# EAGLE design Gram Piano (EAGLE 6.5.0)
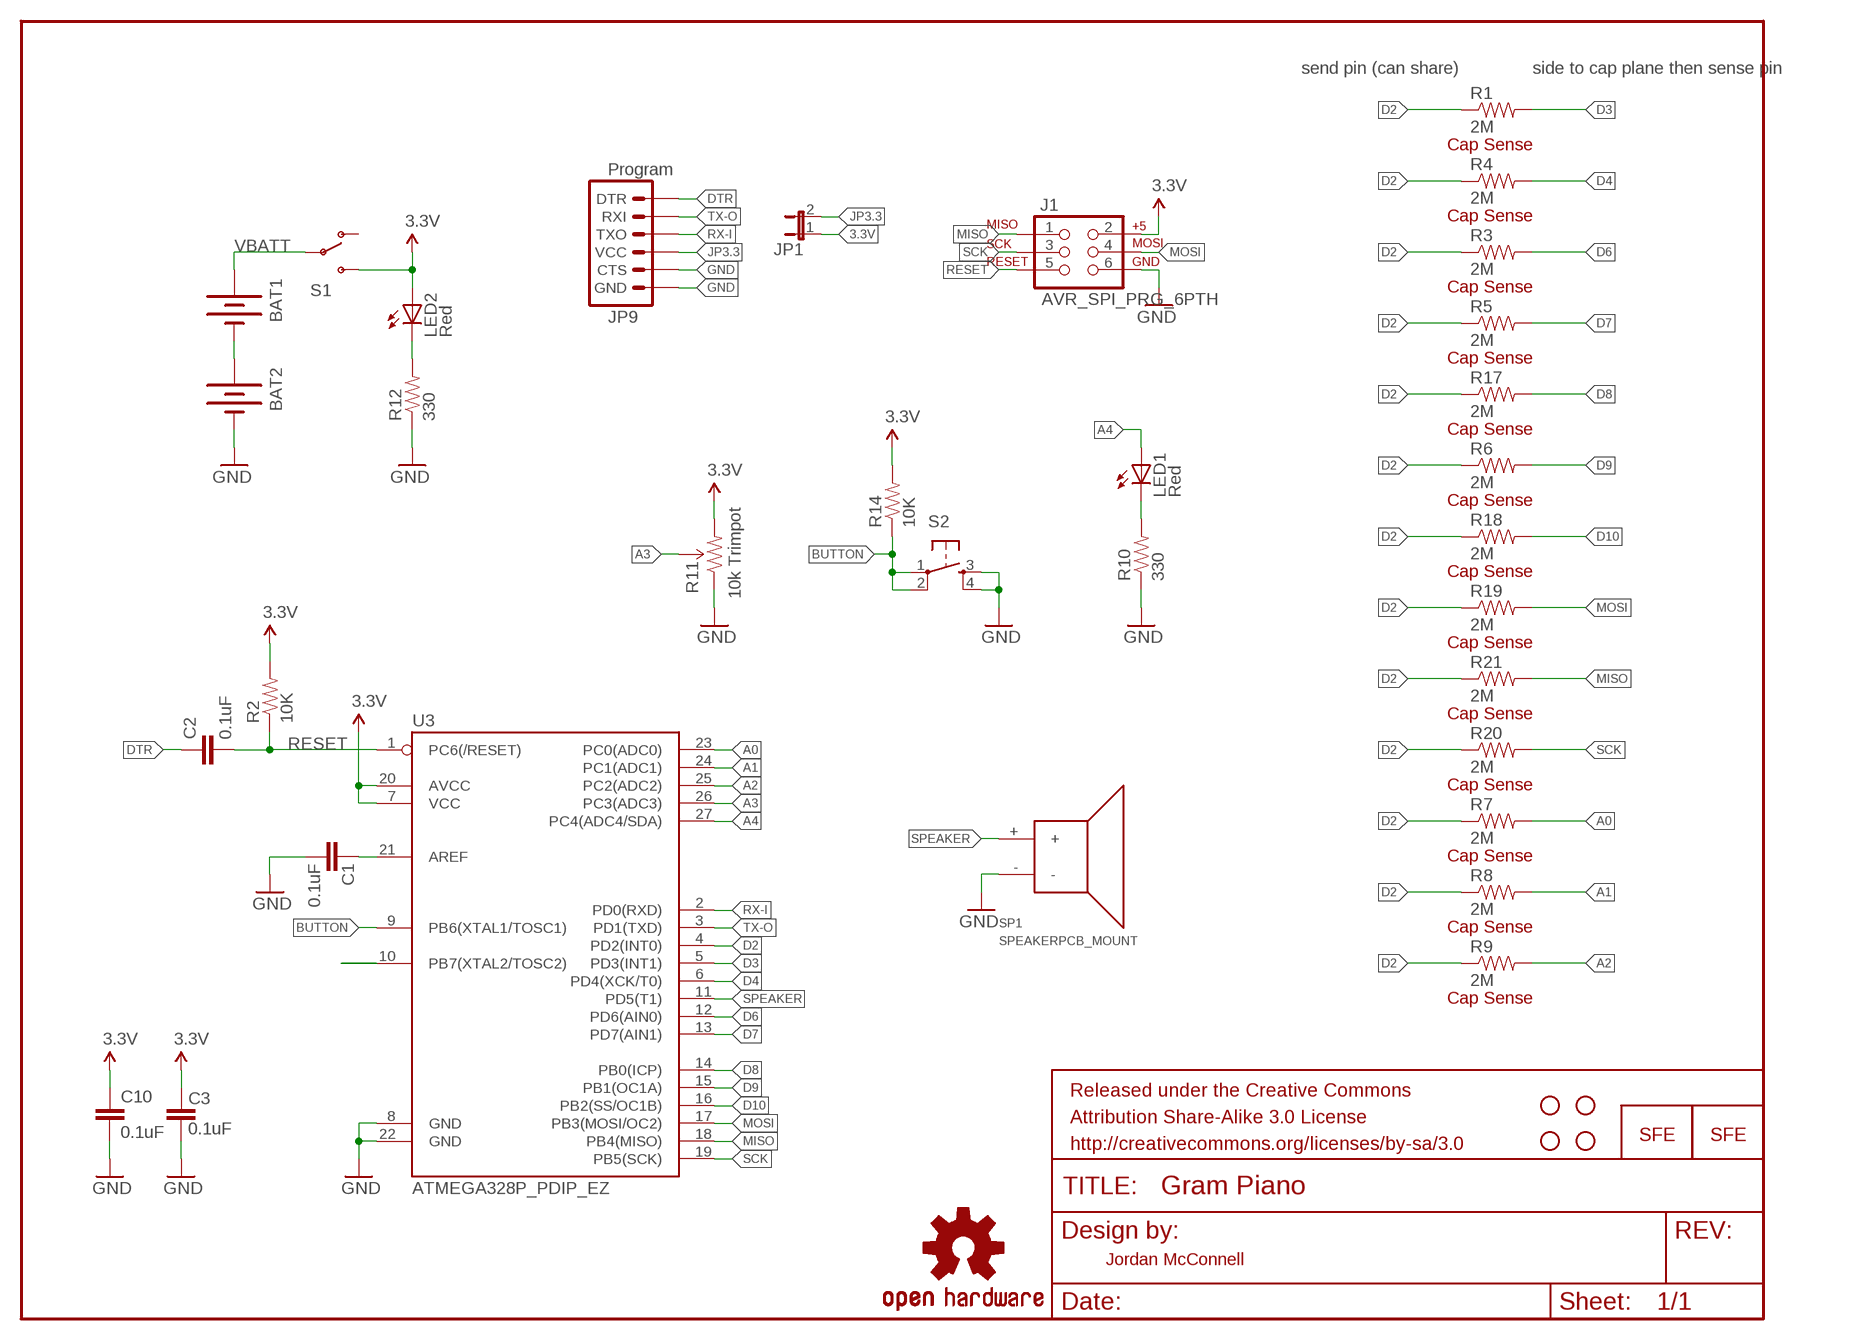
[diagram p0: schematic, sheet 1]

## Parts
BAT1  BATTERYAA-KIT  [BATTERY-AA-KIT]
BAT2  BATTERYAA-KIT  [BATTERY-AA-KIT]
C1  0.1uF  CAPKIT  [CAP-PTH-SMALL-KIT]
C2  0.1uF  CAPKIT  [CAP-PTH-SMALL-KIT]
C3  0.1uF  CAPKIT  [CAP-PTH-SMALL-KIT]
C10  0.1uF  CAPKIT  [CAP-PTH-SMALL-KIT]
FRAME2  FRAME-LETTER  [CREATIVE_COMMONS]
J1  AVR_SPI_PRG_6PTH  [2X3]
JP1  JUMPER-2SMD-NO  [SJ_2S-NO]
JP9  Program  ARDUINO_SERIAL_PROGRAMPTH-KIT  [1X06-KIT]
LED1  Red  LED5MM-KIT  [LED5MM-KIT]
LED2  Red  LED5MM-KIT  [LED5MM-KIT]
LOGO1  LOGO-SFENEW  [SFE-NEW-WEBLOGO]
LOGO2  LOGO-SFENEW  [SFE-NEW-WEBLOGO]
LOGO3  OSHW-LOGOM  [OSHW-LOGO-M]
R1  2M  RESISTORPTH-1/4W  [AXIAL-0.4]
R2  10K  RESISTORPTH-1/4W  [AXIAL-0.4]
R3  2M  RESISTORPTH-1/4W  [AXIAL-0.4]
R4  2M  RESISTORPTH-1/4W  [AXIAL-0.4]
R5  2M  RESISTORPTH-1/4W  [AXIAL-0.4]
R6  2M  RESISTORPTH-1/4W  [AXIAL-0.4]
R7  2M  RESISTORPTH-1/4W  [AXIAL-0.4]
R8  2M  RESISTORPTH-1/4W  [AXIAL-0.4]
R9  2M  RESISTORPTH-1/4W  [AXIAL-0.4]
R10  330  RESISTORPTH-1/4W  [AXIAL-0.4]
R11  TRIMPOT-PTH-KNOB  [3386U]
R12  330  RESISTORPTH-1/4W  [AXIAL-0.4]
R14  10K  RESISTORPTH-1/4W  [AXIAL-0.4]
R17  2M  RESISTORPTH-1/4W  [AXIAL-0.4]
R18  2M  RESISTORPTH-1/4W  [AXIAL-0.4]
R19  2M  RESISTORPTH-1/4W  [AXIAL-0.4]
R20  2M  RESISTORPTH-1/4W  [AXIAL-0.4]
R21  2M  RESISTORPTH-1/4W  [AXIAL-0.4]
S1  SWITCH-SPDTKIT  [SWITCH-SPDT_KIT]
S2  TAC_SWITCHPTH  [TACTILE-PTH]
SP1  SPEAKERPCB_MOUNT  [PCB_MOUNT_SPEAKER]
STANDOFF1  STAND-OFF  [STAND-OFF]
STANDOFF2  STAND-OFF  [STAND-OFF]
STANDOFF3  STAND-OFF  [STAND-OFF]
STANDOFF4  STAND-OFF  [STAND-OFF]
U3  ATMEGA328P_PDIP_EZ  [DIL28-EZ]

## Nets
3.3V: C3.2 C10.1 J1.2 JP1.1 LED2.A R2.P$2 R11.3(CW) R14.P$2 S1.3(S) U3.7(VCC) U3.20(AVCC)
A0: R7.P$2 U3.23(PC0(ADC0))
A1: R8.P$2 U3.24(PC1(ADC1))
A2: R9.P$2 U3.25(PC2(ADC2))
A3: R11.2(WIPER) U3.26(PC3(ADC3))
A4: LED1.A U3.27(PC4(ADC4/SDA))
AREF: C1.2 U3.21(AREF)
BUTTON: R14.P$1 S2.1 S2.2 U3.9(PB6(XTAL1/TOSC1))
D2: R1.P$1 R3.P$1 R4.P$1 R5.P$1 R6.P$1 R7.P$1 R8.P$1 R9.P$1 R17.P$1 R18.P$1 R19.P$1 R20.P$1 R21.P$1 U3.4(PD2(INT0))
D3: R1.P$2 U3.5(PD3(INT1))
D4: R4.P$2 U3.6(PD4(XCK/T0))
D6: R3.P$2 U3.12(PD6(AIN0))
D7 [vcc]: R5.P$2 U3.13(PD7(AIN1))
D8 [vcc]: R17.P$2 U3.14(PB0(ICP))
D9 [vcc]: R6.P$2 U3.15(PB1(OC1A))
D10: R18.P$2 U3.16(PB2(SS/OC1B))
DTR: C2.1 JP9.1(DTR)
GND [vcc]: BAT2.GND@1(-) C1.1 C3.1 C10.2 J1.6 JP9.5(CTS) JP9.6(GND) R10.P$1 R11.1(CCW) R12.P$1 S2.3 S2.4 SP1.- U3.8(GND) U3.22(GND)
JP3.3: JP1.2 JP9.4(VCC)
MISO: J1.1 R21.P$2 U3.18(PB4(MISO))
MOSI: J1.4 R19.P$2 U3.17(PB3(MOSI/OC2))
N$1: LED2.K(C) R12.P$2
N$2: U3.10(PB7(XTAL2/TOSC2))
N$3: BAT1.GND@1(-) BAT2.PWR@1(+)
N$5: LED1.K(C) R10.P$2
RESET: C2.2 J1.5 R2.P$1 U3.1(PC6(/RESET))
RX-I: JP9.3(TXO) U3.2(PD0(RXD))
SCK: J1.3 R20.P$2 U3.19(PB5(SCK))
SPEAKER: SP1.+ U3.11(PD5(T1))
TX-O: JP9.2(RXI) U3.3(PD1(TXD))
VBATT: BAT1.PWR@1(+) S1.2(P)
Unconnected: S1.1(O)

## Notes on the sheet
- send pin (can share) | side to cap plane then sense pin
- Cap Sense
- Cap Sense
- Cap Sense
- Cap Sense
- Cap Sense
- Cap Sense
- Cap Sense
- 10k Trimpot
- Cap Sense
- Cap Sense
- Cap Sense
- Cap Sense
- Cap Sense
- Cap Sense
- Jordan McConnell

## Library data of the parts
BAT1 BAT2 = SparkFun-Electromechanical:BATTERY: Battery Holders Various common sizes : AA, AAA, 20mm coin cell and 12mm coin cell. 20MM_4LEGS, BATT-10373
C1-C3 C10 = SparkFun-Capacitors:CAP: Capacitor Standard 0603 ceramic capacitor, and 0.1" leaded capacitor.
FRAME2 = SparkFun-Aesthetics:FRAME-LETTER: Schematic Frame Standard 8.5x11 US Letter frame
J1 = SparkFun-Connectors:AVR_SPI_PRG_6: AVR ISP 6 Pin This is the reduced ISP connector for AVR programming. Common on Arduino. This footprint will take up less PCB space and can be used with a 10-pin to 6-pin adapter such as SKU: BOB-08508
JP1 = SparkFun-Passives:JUMPER-2: Jumper Basic 0.1" spaced jumper. Use with breakaway headers.
JP9 = SparkFun-Connectors:ARDUINO_SERIAL_PROGRAM: FTDI connector footprints
LED1 LED2 = SparkFun-LED:LED: LEDs Standard schematic elements and footprints for 5mm, 3mm, 1206, and 0603 sized LEDs. 5mm - Spark Fun Electronics SKU : COM-00529 (and others)
LOGO1 LOGO2 = SparkFun-Aesthetics:LOGO-SFE: Spark Fun Electronics PCB Logo This is the standard Spark Fun Electronics PCB logo.
LOGO3 = SparkFun-Aesthetics:OSHW-LOGO: Open Source Hardware Logo This logo indicates the piece of hardware it is found on incorporates a OSHW license and/or adheres to the definition of open source hardware found here: http://freedomdefined.org/OSHW
R1-R10 R12 R14 R17-R21 = SparkFun-Resistors:RESISTOR: Resistor Basic schematic elements and footprints for 0603, 1206, and PTH resistors.
R11 = SparkFun-Electromechanical:TRIMPOT: Various small potentiometers for "set-and-forget" applications
S1 = SparkFun-Electromechanical:SWITCH-SPDT: SPDT Switch Simple slide switch, Spark Fun Electronics SKU : COM-00102 DPDT SMT slide switch, AYZ0202, SWCH-08179
S2 = SparkFun-Electromechanical:TAC_SWITCH: Momentary Switch Button commonly used for reset or general input. Spark Fun Electronics SKU : COM-00097 SMT- SWCH-08247
SP1 = SparkFun-Electromechanical:SPEAKER: General speakers.; MFG: SANCO; PROD_#: NA; SKU: COM-11089; SPARKLE_ID: 6504
STANDOFF1-STANDOFF4 = SparkFun-Electromechanical:STAND-OFF: #4 Stand Off This is the mechanical footprint for a #4 phillips button head screw. Use the keepout ring to avoid running the screw head into surrounding components. SKU : PRT-00447
U3 = SparkFun-DigitalIC:ATMEGA328P_PDIP_EZ: uC used in the Arduino 32kb flash, 1k EEPROM, 2k SRAM This is the through-hole version of this chip.

## Net classes
0 default: width 0.152 mm, drill 0.305 mm, clearance 0.152 mm
1 vcc: width 0.254 mm

## Board
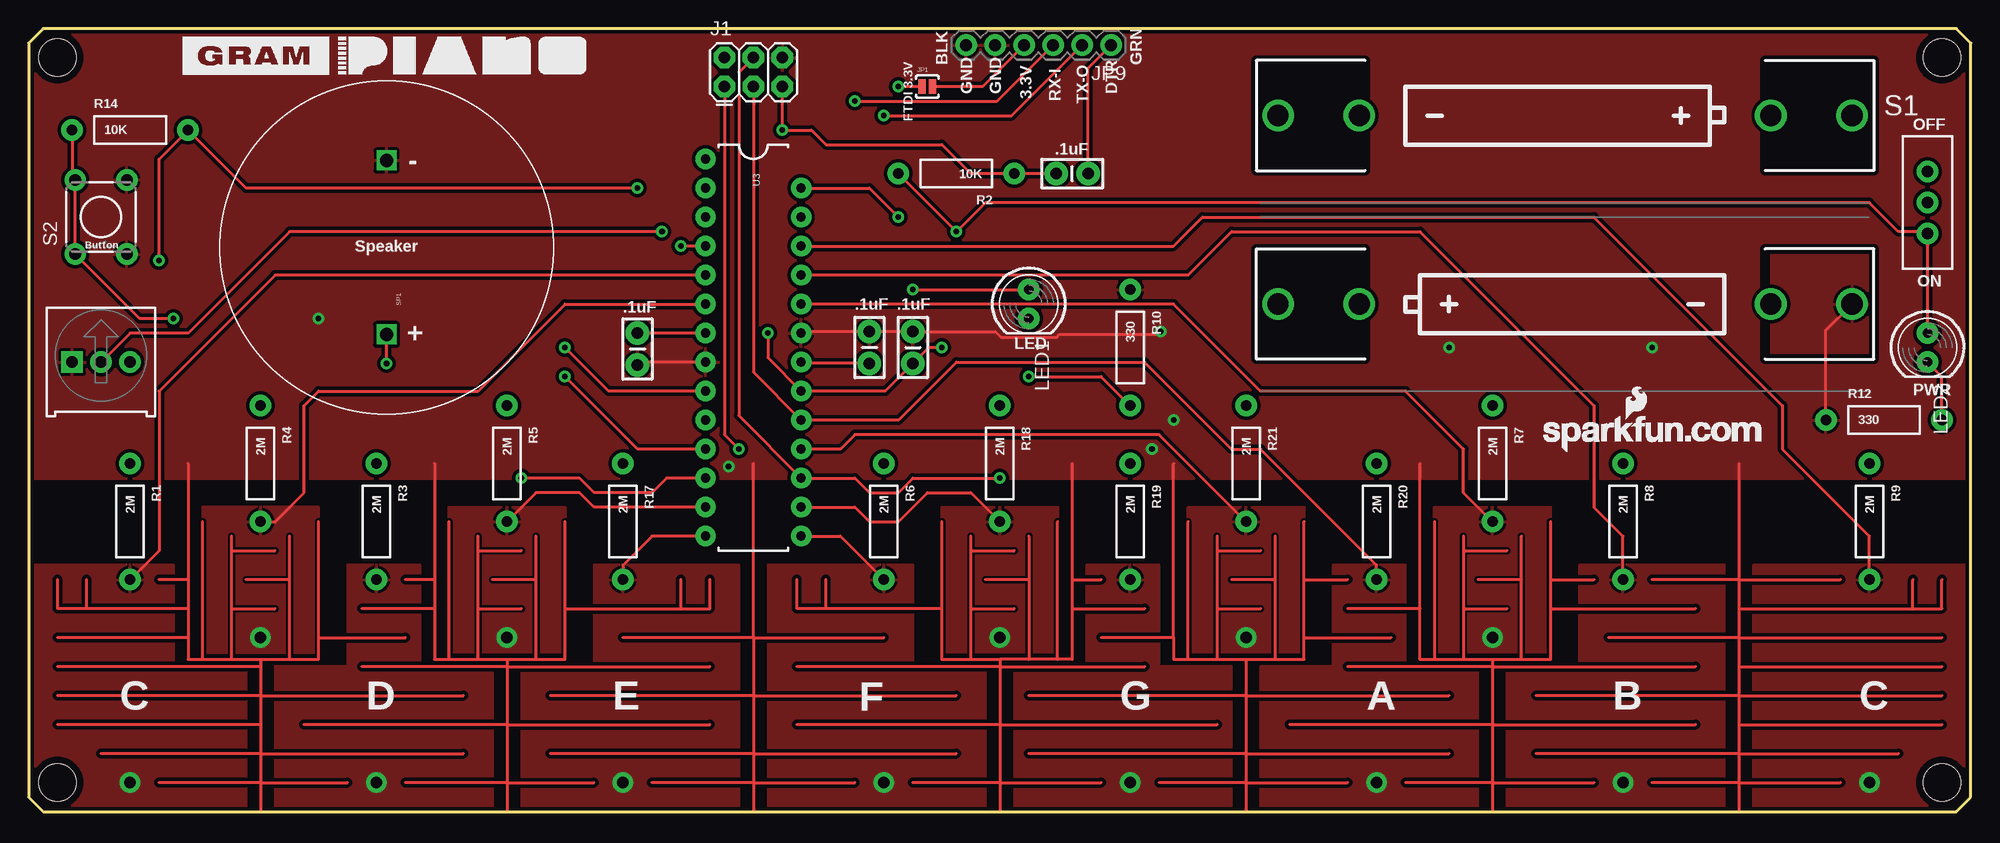
[diagram p1: board, top side]
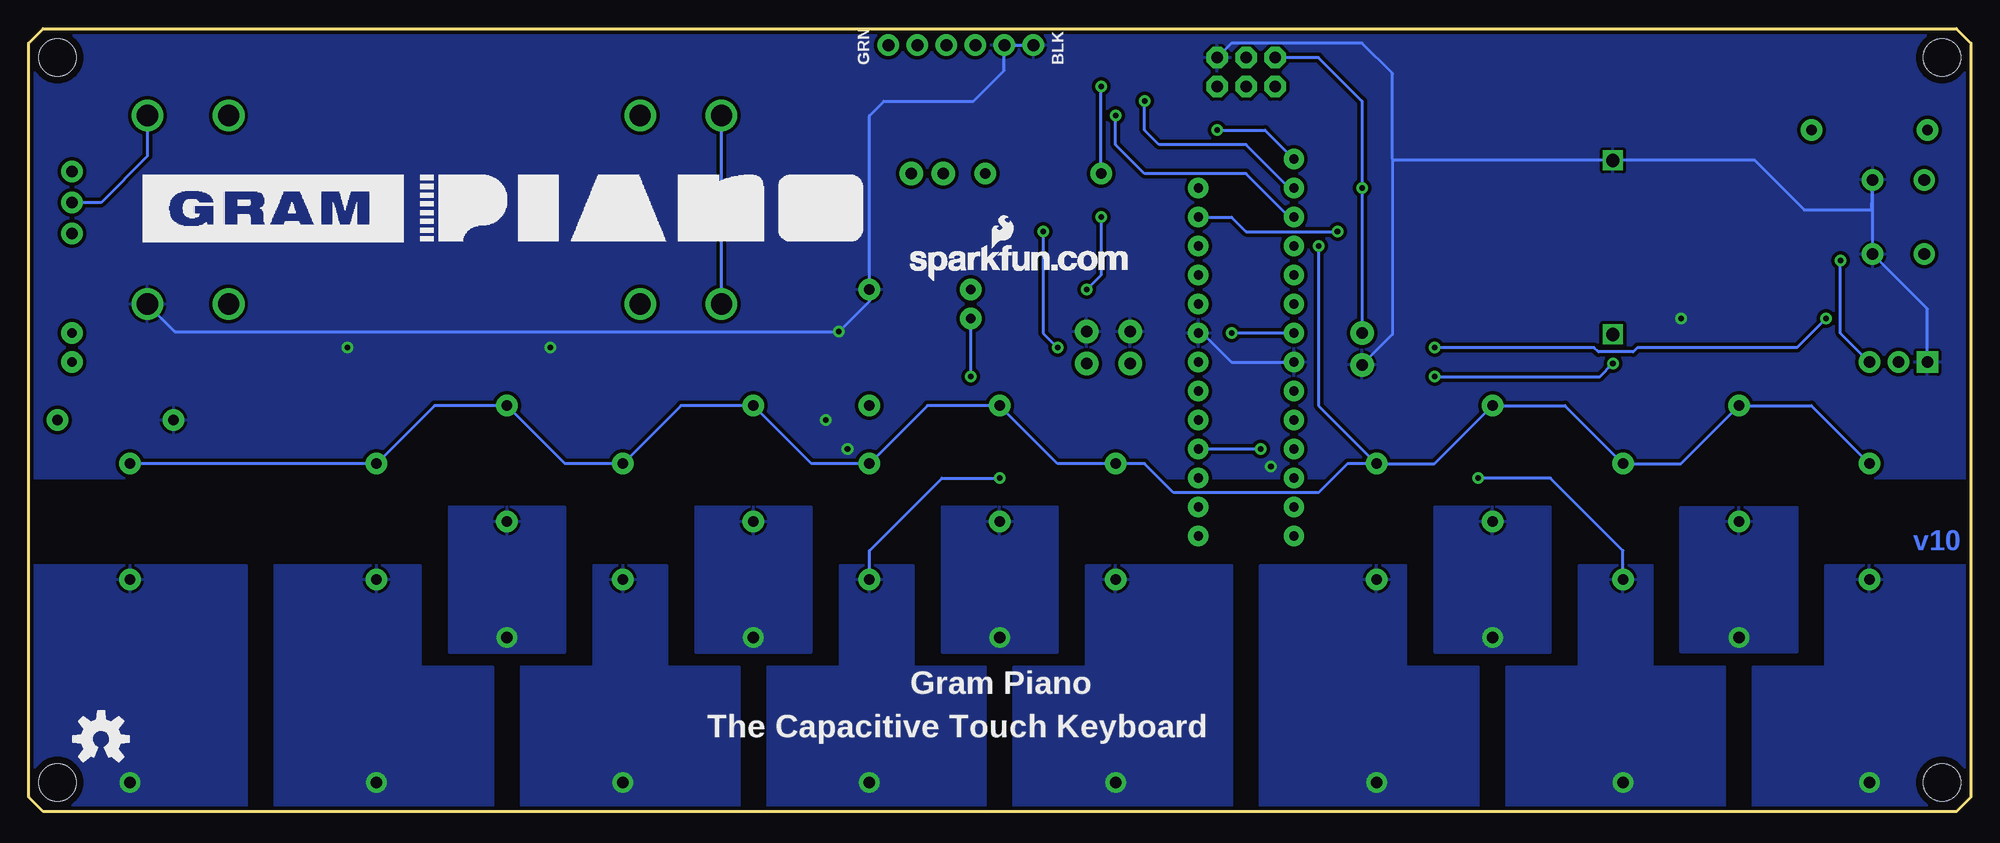
[diagram p2: board, bottom side, seen from below]

Size 170.18 x 68.58 mm. Coordinates in mm from the lower left corner, seen from the top.
Outline: 168.91,68.58 1.27,68.58 0,67.31 0,1.27 1.27,0 168.89,0 170.16,1.26 170.18,67.31 168.91,68.58
Copper layers (1*16): Top 0.035mm / dielectric 1.5mm / Bottom 0.035mm
Design rules "SparkFun": minimum track width 8mil, minimum drill 20mil, track to track 8mil, track to pad 8mil, pad to pad 8mil, via to via 8mil, smd to smd 8mil, copper to edge 8mil, drill to drill 8mil, minimum pad ring 12mil, minimum via ring 10mil, stop-mask expansion 4mil, vias tented up to drill 20mil, thermal gap 10mil

### Footprints (pad centres in the part's own frame; a part is rotated, then mirrored left to right if it is on the bottom)
BATTERY-AA-KIT = drill 1.854: GND@1 25.146,0; GND@2 18.034,0; PWR@1 -25.146,0; PWR@2 -18.034,0
CAP-PTH-SMALL-KIT = drill 1.016 pad 2.032: 1 -1.397,0; 2 1.397,0
2X3 = drill 1.016 pad 1.88 octagon: 1 0,0; 2 0,2.54; 3 2.54,0; 4 2.54,2.54; 5 5.08,0; 6 5.08,2.54
SJ_2S-NO = smd 0.635 x 1.27: 1 -0.45,0; 2 0.45,0
1X06-KIT = drill 1.016 pad 1.88: 1 0,0; 2 2.54,0; 3 5.08,0; 4 7.62,0; 5 10.16,0; 6 12.7,0
LED5MM-KIT = drill 0.813 pad 1.88: A -1.27,0; K 1.27,0
AXIAL-0.4 = drill 0.9 pad 1.88: P$1 -5.08,0; P$2 5.08,0
3386U = drill 1.016 pad 1.88 square: 1 -2.54,-0.015 | drill 1.016 pad 1.88: 2 0,-0.015; 3 2.54,-0.015
SWITCH-SPDT_KIT = drill 1.016 pad 1.88: 1 0,2.718; 2 0,0; 3 0,-2.718
TACTILE-PTH = drill 1.016 pad 1.88: 1 -3.251,2.261; 2 3.251,2.261; 3 -3.251,-2.261; 4 3.251,-2.261
PCB_MOUNT_SPEAKER = drill 1.143 square: + -7.62,0; - 7.62,0
STAND-OFF = hole 3.302: 0,0
DIL28-EZ = drill 0.8 pad 1.778: 1 -16.51,-4.191; 2 -13.97,-4.191; 3 -11.43,-4.191; 4 -8.89,-4.191; 5 -6.35,-4.191; 6 -3.81,-4.191; 7 -1.27,-4.191; 8 1.27,-4.191; 9 3.81,-4.191; 10 6.35,-4.191; 11 8.89,-4.191; 12 11.43,-4.191; 13 13.97,-4.191; 14 16.51,-4.191; 15 16.51,4.191; 16 13.97,4.191; 17 11.43,4.191; 18 8.89,4.191; 19 6.35,4.191; 20 3.81,4.191; 21 1.27,4.191; 22 -1.27,4.191; 23 -3.81,4.191; 24 -6.35,4.191; 25 -8.89,4.191; 26 -11.43,4.191; 27 -13.97,4.191

### Placement (x,y rotation side)
BAT1  134.62,60.96 180 top
BAT2  134.62,44.45 0 top
C1  73.66,40.64 270 top
C2  91.44,55.88 180 top
C3  53.34,40.51 90 top
C10  77.47,40.64 90 top
FRAME2  67.31,-33.02 0 top  (outside the outline)
J1  60.96,63.5 0 top
JP1  78.74,63.5 0 top
JP9  94.84,67.12 180 top
LED1  87.63,44.45 270 top
LED2  166.37,40.64 270 top
LOGO1  132.72,31.5 0 top
LOGO2  92.96,46.48 0 bottom
LOGO3  163.83,6.35 0 bottom
R1  8.89,25.4 270 top
R2  81.28,55.88 180 top
R3  30.48,25.4 270 top
R4  20.32,30.48 270 top
R5  41.91,30.48 270 top
R6  74.93,25.4 270 top
R7  128.27,30.48 270 top
R8  139.7,25.4 270 top
R9  161.29,25.4 270 top
R10  96.52,40.64 270 top
R11  6.35,39.37 0 top
R12  162.56,34.29 0 top
R14  8.89,59.69 0 top
R17  52.07,25.4 270 top
R18  85.09,30.48 270 top
R19  96.52,25.4 270 top
R20  118.11,25.4 270 top
R21  106.68,30.48 270 top
S1  166.37,53.34 0 top
S2  6.35,52.07 90 top
SP1  31.37,49.4 90 top
STANDOFF1  167.64,66.04 0 top
STANDOFF2  167.64,2.54 0 top
STANDOFF3  2.54,2.54 0 top
STANDOFF4  2.54,66.04 0 top
U3  63.5,40.64 270 top

### Tracks (layer width: path | path; a pad name or v marks a point on that pad's centre or on a via)
3.3V  (via drill 0.51)
  Top 0.254: v64.77,41.91 64.77,39.75 U3.20 75.06,36.83 C10.1 78.87,40.64 v80.01,40.64 | LED2.A S1.3 166.19,50.8 163.83,50.8 161.29,53.34 83.82,53.34 v81.28,50.8 R2.P$2 | U3.7 C3.2 | v11.43,48.26 11.43,57.15 R14.P$2 19.05,54.61 v53.34,54.61 | JP1.1 v76.2,63.5
  Bottom 0.254: J1.2 57.15,66.04 53.34,62.23 v53.34,54.61 C3.2 | U3.7 v64.77,41.91 | v81.28,50.8 81.28,41.91 v80.01,40.64 | R11.3 11.43,41.9 v11.43,48.26 | R2.P$2 v76.2,63.5
A0  (via drill 1.02 pad 1.78)
  Top 0.254: R7.P$2 125.73,27.94 125.73,31.75 120.65,36.83 107.95,36.83 100.33,44.45 U3.23
  other vias: 128.27,15.24
  pour Bottom: 133.35,26.67 133.35,13.97 123.19,13.97 123.19,26.67
  pour Top: 133.35,26.67 133.35,13.97 123.19,13.97 123.19,26.67
A1  (via drill 1.02 pad 1.78)
  Top 0.254: R8.P$2 139.7,24.13 137.16,26.67 137.16,35.56 121.92,50.8 105.41,50.8 101.6,46.99 U3.24
  other vias: 139.7,2.54
  pour Top (isolate 0.305): 129.54,0 148.59,0 148.59,21.59 135.89,21.59 135.89,12.7 129.54,12.7
  pour Bottom (isolate 0.305): 129.54,0 148.59,0 148.59,21.59 135.89,21.59 135.89,12.7 129.54,12.7
A2  (via drill 1.02 pad 1.78)
  Top 0.254: R9.P$2 161.29,24.13 153.67,31.75 153.67,35.56 137.16,52.07 102.87,52.07 100.33,49.53 U3.25
  other vias: 161.29,2.54
  pour Top (isolate 0.305): 151.13,0 168.91,0 170.18,1.27 170.18,21.59 151.13,21.59
  pour Bottom (isolate 0.305): 151.13,0 168.91,0 170.18,1.27 170.18,21.59 151.13,21.59
A3  (via drill 0.51)
  Top 0.254: v55.5,50.8 22.86,50.8 13.97,41.91 8.9,41.91 R11.2
  Bottom 0.254: U3.26 64.77,52.07 63.5,50.8 v55.5,50.8
A4  (via drill 0.51)
  Top 0.254: U3.27 73.66,54.61 v76.2,52.07 | v77.47,45.72 LED1.A
  Bottom 0.254: v76.2,52.07 76.2,46.99 v77.47,45.72
AREF
  Top 0.254: C1.2 67.82,39.24 U3.21
BUTTON  (via drill 0.51)
  Top 0.254: R14.P$1 3.81,55.6 S2.2 S2.1 9.73,43.18 v12.7,43.18 | U3.9 50.8,36.83 v46.99,40.64
  Bottom 0.254: v12.7,43.18 15.24,40.64 29.21,40.64 29.59,40.26 32.64,40.26 33.02,40.64 v46.99,40.64
D2  (via drill 0.51)
  Top 0.254: U3.4 v57.15,49.53
  Bottom 0.254: v57.15,49.53 57.15,35.56 R17.P$1 | R17.P$1 46.99,30.48 R5.P$1 35.56,35.56 R3.P$1 25.4,30.48 R4.P$1 13.97,35.56 R1.P$1 | R9.P$1 R8.P$1 134.62,35.56 R7.P$1 123.19,30.48 R20.P$1 113.03,35.56 R21.P$1 101.6,30.48 R19.P$1 91.44,35.56 R18.P$1 80.01,30.48 R6.P$1 72.39,30.48 69.85,27.94 57.15,27.94 54.61,30.48 R17.P$1
D3  (via drill 1.02 pad 1.78)
  Top 0.254: R1.P$2 11.43,22.86 11.43,36.83 21.59,46.99 U3.5
  other vias: 8.89,2.54
  pour Top (isolate 0.305): 0,21.59 0,1.27 1.27,0 19.05,0 19.05,12.7 12.7,12.7 12.7,21.59
  pour Bottom (isolate 0.305): 0,21.59 0,1.27 1.27,0 19.05,0 19.05,12.7 12.7,12.7 12.7,21.59
D4  (via drill 1.02 pad 1.78)
  Top 0.254: R4.P$2 21.59,25.4 24.13,27.94 24.13,35.56 25.4,36.83 39.37,36.83 46.99,44.45 U3.6
  other vias: 20.32,15.24
  pour Bottom: 15.24,26.67 15.24,13.97 25.4,13.97 25.4,26.67
  pour Top: 15.24,26.67 15.24,13.97 25.4,13.97 25.4,26.67
D6  (via drill 0.51, 1.02 pad 1.78)
  Top 0.254: U3.12 55.88,29.21 54.61,27.94 49.53,27.94 48.26,29.21 v43.18,29.21
  Bottom 0.254: R3.P$2 30.48,22.86 36.83,29.21 v43.18,29.21
  other vias: 30.48,2.54
  pour Top (isolate 0.305): 21.59,0 40.64,0 40.64,12.7 34.29,12.7 34.29,21.59 27.94,21.59 27.94,12.7 21.59,12.7
  pour Bottom (isolate 0.305): 21.59,0 40.64,0 40.64,12.7 34.29,12.7 34.29,21.59 27.94,21.59 27.94,12.7 21.59,12.7
D7  (via drill 1.02 pad 1.78)
  Top 0.254: U3.13 49.53,26.67 48.26,27.94 44.45,27.94 R5.P$2
  other vias: 41.91,15.24
  pour Bottom: 46.99,26.67 46.99,13.97 36.83,13.97 36.83,26.67
  pour Top: 46.99,26.67 46.99,13.97 36.83,13.97 36.83,26.67
D8  (via drill 1.02 pad 1.78)
  Top 0.254: U3.14 54.61,24.13 52.07,21.59 R17.P$2
  other vias: 52.07,2.54
  pour Top (isolate 0.305): 43.18,0 62.23,0 62.23,21.59 49.53,21.59 49.53,12.7 43.18,12.7
  pour Bottom (isolate 0.305): 43.18,0 62.23,0 62.23,21.59 49.53,21.59 49.53,12.7 43.18,12.7
D9  (via drill 1.02 pad 1.78)
  Top 0.254: U3.15 71.12,24.13 R6.P$2
  other vias: 74.93,2.54
  pour Top (isolate 0.305): 64.77,0 83.82,0 83.82,12.7 77.47,12.7 77.47,21.59 64.77,21.59
  pour Bottom (isolate 0.305): 64.77,0 83.82,0 83.82,12.7 77.47,12.7 77.47,21.59 64.77,21.59
D10  (via drill 1.02 pad 1.78)
  Top 0.254: U3.16 72.39,26.67 73.66,25.4 76.2,25.4 78.74,27.94 82.55,27.94 R18.P$2
  other vias: 85.09,15.24
  pour Bottom: 90.17,26.67 90.17,13.97 80.01,13.97 80.01,26.67
  pour Top: 90.17,26.67 90.17,13.97 80.01,13.97 80.01,26.67
DTR
  Top 0.254: C2.1 92.84,65.12 JP9.1
GND  (via drill 0.51)
  Top 0.254: U3.22 67.82,42.04 C1.1 C10.2 84.71,42.04 85.22,41.53 90.04,41.53 90.3,41.78 98.93,41.78 v99.19,42.04 | R12.P$1 157.48,42.16 BAT2.GND@1 | U3.8 53.59,39.37 C3.1 | 13.97,30.48 13.97,20.32 | 13.97,20.32 13.97,17.78 | 13.97,17.78 13.97,15.24 | 13.97,15.24 13.97,13.34 15.24,13.34 | 15.24,13.34 17.78,13.34 | 17.78,13.34 20.32,13.34 | 20.32,13.34 20.32,12.7 | 20.32,12.7 20.32,10.16 | 20.32,10.16 20.32,7.62 | 20.32,7.62 20.32,5.08 | 20.32,5.08 20.32,2.54 | 20.32,2.54 20.32,0 | 35.56,30.48 35.56,20.32 | 35.56,20.32 35.56,17.78 | 35.56,17.78 35.56,13.34 36.83,13.34 | 36.83,13.34 39.37,13.34 | 39.37,13.34 41.91,13.34 | 41.91,13.34 41.91,12.7 | 41.91,12.7 41.91,7.62 | 41.91,7.62 41.91,2.54 | 41.91,2.54 41.91,0 | 39.37,13.34 39.37,17.78 | 39.37,17.78 39.37,22.86 | 39.37,22.86 39.37,24.13 | 39.37,22.86 43.18,22.86 | 41.91,13.34 44.45,13.34 | 44.45,13.34 46.99,13.34 46.99,17.78 | 44.45,13.34 44.45,20.32 | 44.45,20.32 44.45,24.13 | 63.5,15.24 63.5,10.16 | 63.5,10.16 63.5,5.08 | 63.5,5.08 63.5,2.54 | 63.5,2.54 63.5,0 | 63.5,15.24 52.07,15.24 | 63.5,10.16 45.72,10.16 | 63.5,5.08 45.72,5.08 | 63.5,2.54 54.61,2.54 | 63.5,15.24 74.93,15.24 | 63.5,10.16 81.28,10.16 | 63.5,5.08 81.28,5.08 | 91.44,30.48 91.44,20.32 | 91.44,20.32 91.44,17.78 | 91.44,17.78 91.44,13.34 90.17,13.34 | 90.17,13.34 87.63,13.34 | 87.63,13.34 85.09,13.34 | 85.09,13.34 85.09,12.7 | 85.09,12.7 85.09,7.62 | 85.09,7.62 85.09,2.54 | 85.09,2.54 85.09,0 | 85.09,12.7 97.79,12.7 | 85.09,7.62 104.14,7.62 | 85.09,2.54 93.98,2.54 | 100.33,15.24 100.33,13.34 101.6,13.34 | 101.6,13.34 104.14,13.34 | 104.14,13.34 106.68,13.34 | 106.68,13.34 106.68,10.16 | 106.68,10.16 106.68,5.08 | 106.68,5.08 106.68,2.54 | 106.68,2.54 106.68,0
  Top 0.254: 100.33,15.24 93.98,15.24 | 106.68,10.16 87.63,10.16 | 106.68,5.08 87.63,5.08 | 106.68,2.54 99.06,2.54 | 123.19,13.34 121.92,13.34 121.92,17.78 | 123.19,13.34 125.73,13.34 | 125.73,13.34 128.27,13.34 | 128.27,13.34 128.27,12.7 | 128.27,12.7 128.27,7.62 | 128.27,7.62 128.27,2.54 | 128.27,2.54 128.27,0 | 128.27,7.62 110.49,7.62 | 149.86,30.48 149.86,20.32 | 149.86,20.32 149.86,17.78 | 149.86,17.78 149.86,15.24 | 149.86,15.24 149.86,12.7 | 149.86,12.7 149.86,10.16 | 149.86,10.16 149.86,7.62 | 149.86,7.62 149.86,5.08 | 149.86,5.08 149.86,2.54 | 149.86,2.54 149.86,0 | 149.86,15.24 167.64,15.24 | 149.86,12.7 167.64,12.7 | 149.86,10.16 167.64,10.16 | 149.86,7.62 167.64,7.62 | 149.86,5.08 163.83,5.08 | 149.86,2.54 158.75,2.54 | 149.86,15.24 138.43,15.24 | 149.86,10.16 132.08,10.16 | 149.86,5.08 132.08,5.08 | 149.86,2.54 142.24,2.54 | 121.92,17.78 121.92,30.48 | 100.33,15.24 100.33,30.48 | 63.5,15.24 63.5,30.48 | 20.32,13.34 22.86,13.34 | 22.86,13.34 25.4,13.34 25.4,15.24 | 20.32,2.54 11.43,2.54 | 20.32,5.08 6.35,5.08 | 20.32,7.62 2.54,7.62 | 20.32,10.16 2.54,10.16 | 20.32,12.7 2.54,12.7 | 13.97,15.24 2.54,15.24 | 13.97,17.78 5.08,17.78 | 5.08,17.78 2.54,17.78 2.54,20.32 | 5.08,17.78 5.08,20.32 | 13.97,20.32 11.43,20.32 | 149.86,20.32 158.75,20.32 | 149.86,17.78 165.1,17.78 | 165.1,17.78 167.64,17.78 167.64,20.32 | 165.1,17.78 165.1,20.32 | 149.86,20.32 142.24,20.32 | 20.32,2.54 27.94,2.54 | 41.91,2.54 33.02,2.54 | 20.32,5.08 38.1,5.08 | 41.91,7.62 24.13,7.62 | 20.32,10.16 38.1,10.16 | 41.91,12.7 29.21,12.7 | 35.56,17.78 29.21,17.78 | 44.45,20.32 40.64,20.32 | 39.37,17.78 43.18,17.78 | 41.91,2.54 49.53,2.54 | 41.91,7.62 59.69,7.62 | 41.91,12.7 59.69,12.7 | 35.56,20.32 33.02,20.32
  Top 0.254: 85.09,2.54 77.47,2.54 | 63.5,2.54 72.39,2.54 | 85.09,7.62 67.31,7.62 | 85.09,12.7 67.31,12.7 | 91.44,17.78 97.79,17.78 | 91.44,20.32 93.98,20.32 | 106.68,10.16 124.46,10.16 | 106.68,5.08 124.46,5.08 | 106.68,2.54 115.57,2.54 | 128.27,2.54 120.65,2.54 | 128.27,12.7 115.57,12.7 | 121.92,17.78 115.57,17.78 | 128.27,2.54 137.16,2.54 | 128.27,7.62 146.05,7.62 | 128.27,12.7 146.05,12.7 | 123.19,25.4 123.19,13.34 | 125.73,24.13 125.73,22.86 | 125.73,22.86 125.73,17.78 | 125.73,17.78 125.73,13.34 | 125.73,22.86 129.54,22.86 | 125.73,17.78 129.54,17.78 | 130.81,13.34 130.81,20.32 | 130.81,20.32 130.81,24.13 | 130.81,20.32 127,20.32 | 104.14,24.13 104.14,22.86 | 104.14,22.86 104.14,17.78 | 104.14,17.78 104.14,13.34 | 104.14,22.86 107.95,22.86 | 104.14,17.78 107.95,17.78 | 101.6,13.34 101.6,25.4 | 133.35,25.4 133.35,20.32 | 133.35,20.32 133.35,17.78 | 133.35,17.78 133.35,13.34 130.81,13.34 | 128.27,13.34 130.81,13.34 | 133.35,17.78 146.05,17.78 | 133.35,20.32 137.16,20.32 | 111.76,15.24 111.76,13.34 109.22,13.34 | 111.76,15.24 111.76,20.32 | 111.76,20.32 111.76,25.4 | 106.68,13.34 109.22,13.34 | 109.22,24.13 109.22,20.32 | 109.22,20.32 109.22,13.34 | 109.22,20.32 105.41,20.32 | 111.76,15.24 119.38,15.24 | 111.76,20.32 115.57,20.32 | 82.55,13.34 80.01,13.34 80.01,17.78 | 82.55,13.34 85.09,13.34 | 82.55,13.34 82.55,17.78 | 82.55,17.78 82.55,22.86 | 82.55,22.86 82.55,24.13 | 82.55,22.86 86.36,22.86 | 82.55,17.78 86.36,17.78 | 80.01,17.78 80.01,25.4 | 80.01,17.78 69.85,17.78 | 69.85,17.78 67.31,17.78 67.31,20.32 | 69.85,17.78 69.85,20.32 | 46.99,17.78 46.99,25.4 | 46.99,17.78 57.15,17.78 | 57.15,17.78 59.69,17.78 59.69,20.32 | 57.15,17.78 57.15,20.32 | 36.83,13.34 36.83,25.4
  Top 0.254: 15.24,13.34 15.24,25.4 | 17.78,13.34 17.78,17.78 | 17.78,17.78 17.78,22.86 | 17.78,22.86 17.78,24.13 | 17.78,17.78 21.59,17.78 | 17.78,22.86 21.59,22.86 | 22.86,13.34 22.86,20.32 | 22.86,20.32 22.86,24.13 | 22.86,20.32 19.05,20.32 | 25.4,15.24 25.4,25.4 | 25.4,15.24 33.02,15.24 | 87.63,24.13 87.63,20.32 | 87.63,20.32 87.63,13.34 | 87.63,20.32 83.82,20.32 | 90.17,13.34 90.17,25.4
  Bottom 0.254: J1.6 64.77,67.31 53.34,67.31 50.67,64.64 50.67,57.15 | U3.22 67.31,41.91 64.77,39.37 U3.8 | R11.1 3.81,44.02 S2.3 S2.4 8.69,52.7 14.61,52.7 18.92,57.02 SP1.- 50.55,57.02 50.67,57.15 | JP9.6 JP9.5 84.71,67.09 84.71,64.9 87.38,62.23 95.25,62.23 96.52,60.96 R10.P$1 96.52,44.7 v99.19,42.04 157.35,42.04 BAT2.GND@1 | 50.67,57.15 50.67,41.78 C3.1
  other vias: 100.33,34.29 124.46,40.64 142.24,40.64 25.4,43.18 98.42,31.75 61.34,30.23
  pour Bottom (isolate 0.305): 168.91,68.58 1.27,68.58 0,67.31 0,29.21 170.18,29.21 170.18,67.31
  pour Top (isolate 0.305): 170.18,29.21 170.18,67.31 168.91,68.58 1.27,68.58 0,67.31 0,29.21
JP3.3
  Top 0.254: JP9.4 83.6,63.5 JP1.2
MISO  (via drill 0.51, 1.02 pad 1.78)
  Top 0.254: R21.P$2 99.06,33.02 72.39,33.02 71.12,31.75 U3.18 | J1.1 60.96,33.02 v62.23,31.75
  Bottom 0.254: v62.23,31.75 U3.18
  other vias: 106.68,15.24
  pour Bottom: 111.76,26.67 111.76,13.97 101.6,13.97 101.6,26.67
  pour Top: 111.76,26.67 111.76,13.97 101.6,13.97 101.6,26.67
MOSI  (via drill 0.51, 1.02 pad 1.78)
  Top 0.254: J1.4 62.23,64.77 62.23,34.67 U3.17 72.39,29.21 73.66,27.94 76.2,27.94 77.47,29.21 v85.09,29.21
  Bottom 0.254: R19.P$2 96.52,22.86 90.17,29.21 v85.09,29.21
  other vias: 96.52,2.54
  pour Top (isolate 0.305): 86.36,0 105.41,0 105.41,12.7 99.06,12.7 99.06,21.59 92.71,21.59 92.71,12.7 86.36,12.7
  pour Bottom (isolate 0.305): 86.36,0 105.41,0 105.41,12.7 99.06,12.7 99.06,21.59 92.71,21.59 92.71,12.7 86.36,12.7
N$1
  Top 0.254: R12.P$2 167.64,38.1 LED2.K
N$3
  Bottom 0.254: BAT2.PWR@1 BAT1.GND@1
N$5  (via drill 0.51)
  Top 0.254: v87.63,38.1 93.98,38.1 R10.P$2
  Bottom 0.254: LED1.K v87.63,38.1
RESET  (via drill 0.51)
  Top 0.254: C2.2 R2.P$1 82.55,55.88 80.01,58.42 69.85,58.42 68.58,59.69 v66.04,59.69 J1.5
  Bottom 0.254: v66.04,59.69 61.85,59.69 U3.1
RX-I  (via drill 0.51)
  Top 0.254: v72.39,62.23 84.87,62.23 JP9.3
  Bottom 0.254: U3.2 59.69,54.61 63.5,58.42 71.12,58.42 72.39,59.69 v72.39,62.23
SCK  (via drill 1.02 pad 1.78)
  Top 0.254: R20.P$2 118.11,21.59 107.95,31.75 105.41,31.75 97.79,39.37 81.28,39.37 76.2,34.29 U3.19 63.5,38.48 J1.3
  other vias: 118.11,2.54
  pour Top (isolate 0.305): 107.95,0 127,0 127,12.7 120.65,12.7 120.65,21.59 114.3,21.59 114.3,12.7 107.95,12.7
  pour Bottom (isolate 0.305): 107.95,0 127,0 127,12.7 120.65,12.7 120.65,21.59 114.3,21.59 114.3,12.7 107.95,12.7
SPEAKER  (via drill 0.51)
  Top 0.254: U3.11 53.34,31.75 v46.99,38.1 | v31.37,39.24 SP1.+
  Bottom 0.254: v46.99,38.1 32.51,38.1 v31.37,39.24
TX-O  (via drill 0.51)
  Top 0.254: v74.93,60.96 86.14,60.96 JP9.2
  Bottom 0.254: U3.3 59.69,52.07 63.5,55.88 72.39,55.88 74.93,58.42 v74.93,60.96
VBATT
  Bottom 0.254: BAT1.PWR@1 159.77,57.4 163.83,53.34 S1.2

### Text on the board
Bottom: v10
tPlace: BLK | GRN | GND | GND | DTR | 3.3V | RX-I | TX-O | FTDI 3.3V | OFF | .1uF | - | Button | Speaker | ON | .1uF | .1uF | .1uF | + | LED | PWR | C | D | E | F | G | A | B | C
bPlace: BLK | GRN | Gram Piano | The Capacitive Touch Keyboard
Reference: Jordan McConnell